# EAGLE design Qwiic_RockBLOCK_9603N (EAGLE 9.4.1)
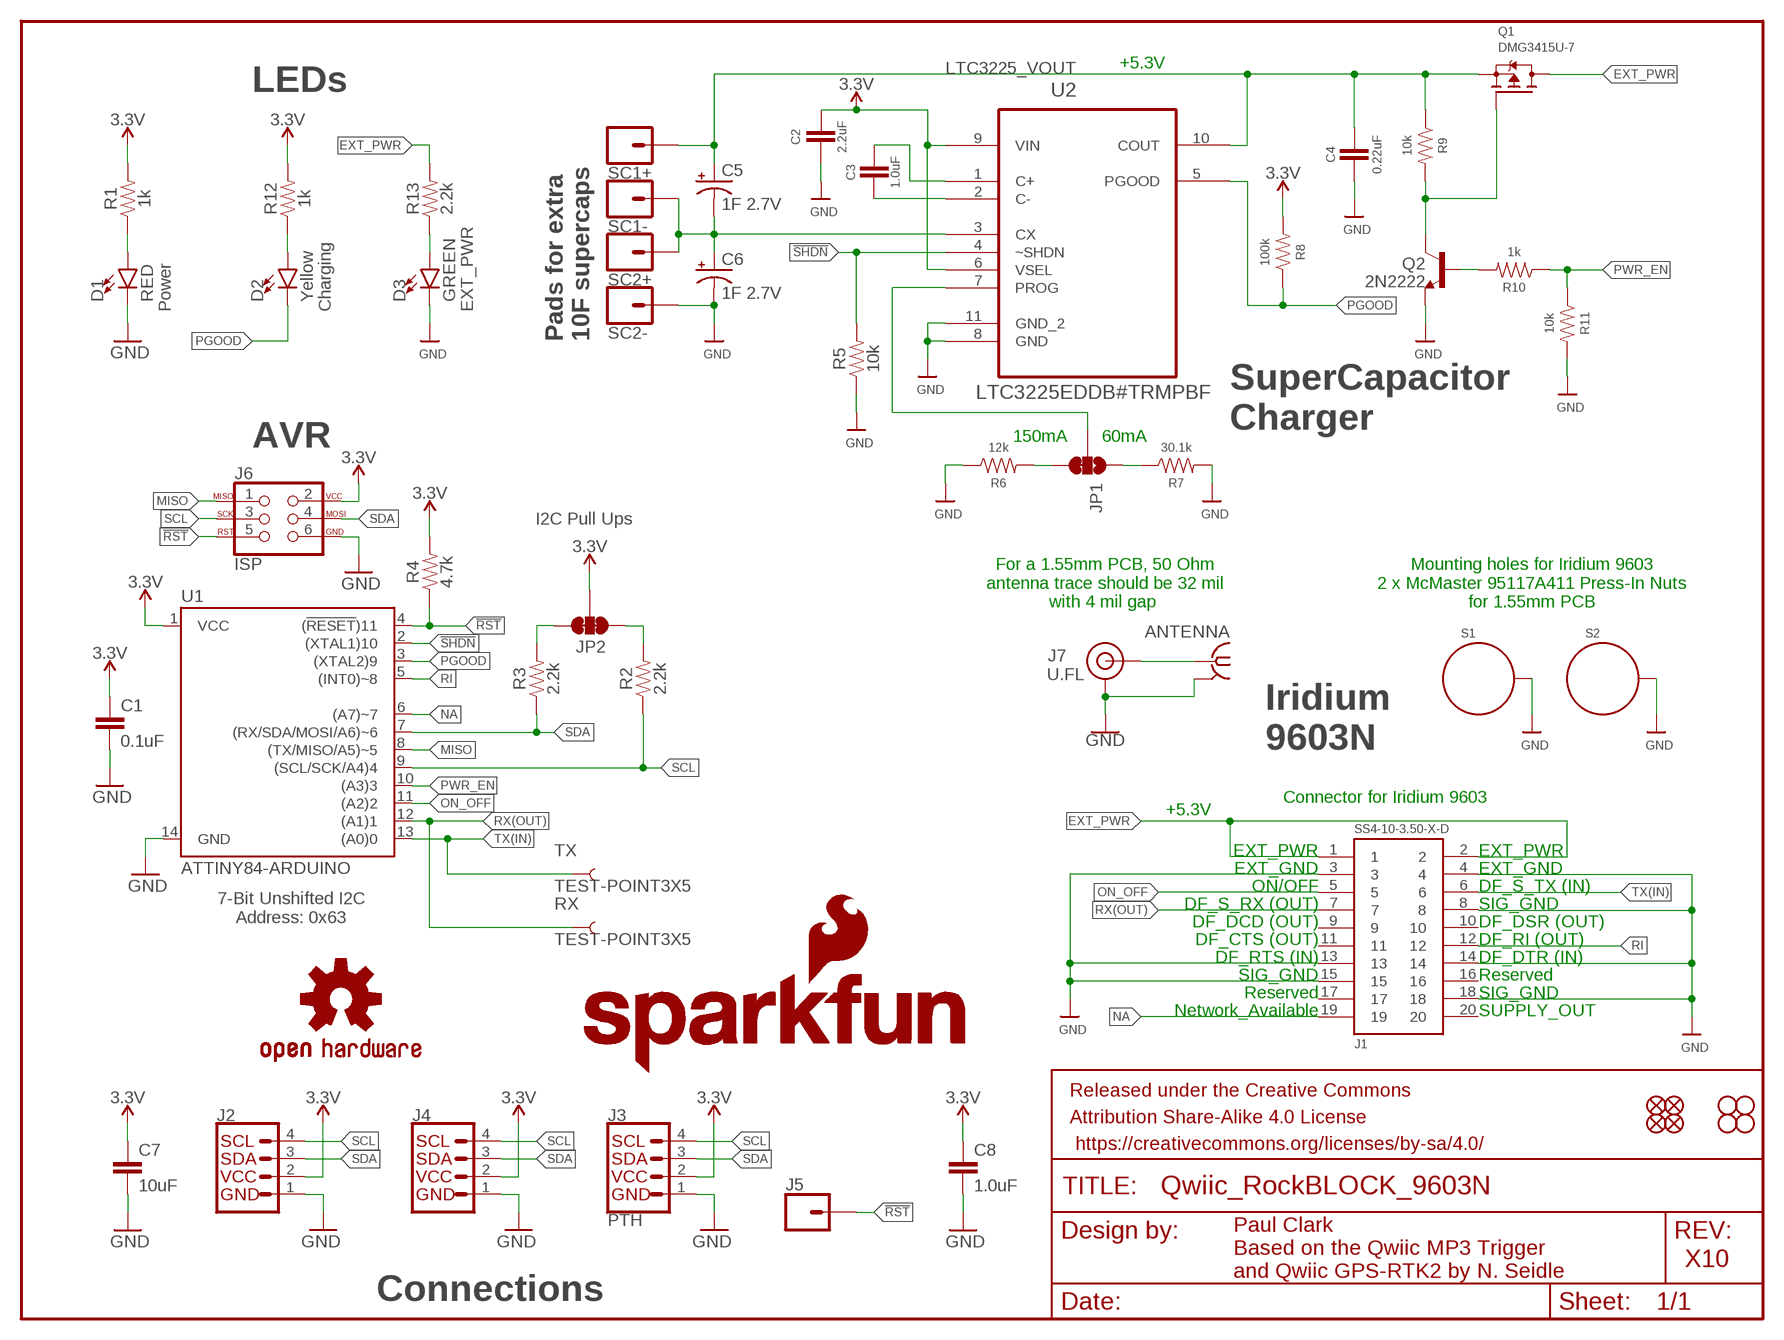
[diagram p0: schematic, sheet 1]

## Parts
ANTENNA  SMA-142-0711-821/826  [J502-ND-142-0711-821/826]
C1  0.1uF  0.1UF-0603-25V-(+80/-20%)  [0603]
C2  2.2uF  2.2UF-0603-10V-20%  [0603]
C3  1.0uF  1.0UF-0603-16V-10%  [0603]
C4  0.22uF  0.22UF-0603-25V-10%  [0603]
C5  1F 2.7V  1F-2.7V(PTH)CPOL-RADIAL-1H-2.7V  [CPOL-RADIAL-1F-2.7V]
C6  1F 2.7V  1F-2.7V(PTH)CPOL-RADIAL-1H-2.7V  [CPOL-RADIAL-1F-2.7V]
C7  10uF  10UF-0603-6.3V-20%  [0603]
C8  1.0uF  1.0UF-0603-16V-10%  [0603]
D1  RED  LED-RED0603  [LED-0603]
D2  Yellow  LED-YELLOW0603  [LED-0603]
D3  GREEN  LED-GREEN0603  [LED-0603]
FRAME1  FRAME-LETTER  [CREATIVE_COMMONS]
J1  SS4-10-3.50-X-D  [SS4-10-3.50-X-D]
J2  QWIIC_CONNECTORJS-1MM  [1X04_1MM_RA]
J3  PTH  I2C_STANDARD_NO_SILK  [1X04_NO_SILK]
J4  QWIIC_CONNECTORJS-1MM  [1X04_1MM_RA]
J5  CONN_01PTH_NO_SILK_YES_STOP  [1X01_NO_SILK]
J6  ISP  AVR_SPI_PROG_3X2TESTPOINTS  [2X3_TEST_POINTS]
J7  U.FL  U.FL2PIN  [U.FL]
JP1  JUMPER-PAD-3-2OF3_NC_BY_TRACE_LARGE  [PAD-JUMPER-3-2OF3_NC_BY_TRACE_YES_SILK_LARGE]
JP2  JUMPER-SMT_3_2-NC_TRACE_SILK  [SMT-JUMPER_3_2-NC_TRACE_SILK]
JP3  STAND-OFF  [STAND-OFF]
JP4  STAND-OFF  [STAND-OFF]
JP5  FIDUCIALUFIDUCIAL  [MICRO-FIDUCIAL]
JP6  FIDUCIALUFIDUCIAL  [MICRO-FIDUCIAL]
JP7  FIDUCIALUFIDUCIAL  [MICRO-FIDUCIAL]
JP8  FIDUCIALUFIDUCIAL  [MICRO-FIDUCIAL]
JP9  STAND-OFF  [STAND-OFF]
JP10  STAND-OFF  [STAND-OFF]
LOGO1  OSHW-LOGOMINI  [OSHW-LOGO-MINI]
LOGO2  SFE_LOGO_NAME.1_INCH  [SFE_LOGO_NAME_.1]
LOGO3  SFE_LOGO_NAME_FLAME.1_INCH  [SFE_LOGO_NAME_FLAME_.1]
Q1  DMG3415U-7  MOSFET-PWIDE  [SOT23-WIDE]
Q2  2N2222  MMBT2222ALT1-NPN-SOT23-BEC  [SOT23-BEC]
R1  1k  1KOHM-0603-1/10W-1%  [0603]
R2  2.2k  2.2KOHM-0603-1/10W-1%  [0603]
R3  2.2k  2.2KOHM-0603-1/10W-1%  [0603]
R4  4.7k  4.7KOHM-0603-1/10W-1%  [0603]
R5  10k  10KOHM-0603-1/10W-1%  [0603]
R6  12k  12KOHM-0603-1/10W-1%  [0603]
R7  30.1k  30.1KOHM-0603-1/10W-1%  [0603]
R8  100k  100KOHM-0603-1/10W-1%  [0603]
R9  10k  10KOHM-0603-1/10W-1%  [0603]
R10  1k  1KOHM-0603-1/10W-1%  [0603]
R11  10k  10KOHM-0603-1/10W-1%  [0603]
R12  1k  1KOHM-0603-1/10W-1%  [0603]
R13  2.2k  2.2KOHM-0603-1/10W-1%  [0603]
RX  TEST-POINT3X5  [PAD.03X.05]
S1  STANDOFF_ELECTRICALMCMASTER-95117A411  [STANDOFF-ELECTRICAL-MCMASTER-95117A411]
S2  STANDOFF_ELECTRICALMCMASTER-95117A411  [STANDOFF-ELECTRICAL-MCMASTER-95117A411]
SC1+  CONN_01PTH_NO_SILK_YES_STOP  [1X01_NO_SILK]
SC1-  CONN_01PTH_NO_SILK_YES_STOP  [1X01_NO_SILK]
SC2+  CONN_01PTH_NO_SILK_YES_STOP  [1X01_NO_SILK]
SC2-  CONN_01PTH_NO_SILK_YES_STOP  [1X01_NO_SILK]
TX  TEST-POINT3X5  [PAD.03X.05]
U1  ATTINY84-ARDUINO  [SO14]
U2  LTC3225EDDB#TRMPBF  LTC3225EDDB-TRMPBFDFN300X200-10L  [DFN300X200-10L]

## Nets
3.3V [3.3V]: C1.1 C2.1 C7.1 C8.1 J2.2 J3.2(VCC) J4.2 J6.2 JP2.2 R1.2 R4.2 R8.2 R12.2 U1.1(VCC) U2.6(VSEL) U2.9(VIN)
!RST: J5.1 J6.5 R4.1 U1.4((!RESET!)11)
!SHDN: R5.2 U1.2((XTAL1)10) U2.4(~SHDN)
EXT_PWR: J1.1 J1.2 Q1.3(D) R13.2
GND: ANTENNA.G@1 ANTENNA.G@2 ANTENNA.G@3 ANTENNA.G@4 C1.2 C2.2 C4.2 C6.- C7.2 C8.2 D1.C D3.C J1.3 J1.4 J1.8 J1.13 J1.14 J1.15 J1.18 J2.1 J3.1(GND) J4.1 J6.6 J7.1(GND) J7.2(GND) Q2.E R5.1 R6.1 R7.2 R11.2 S1.P1 S2.P1 SC2-.1 U1.14(GND) U2.8(GND) U2.11(GND_2)
LTC3225_VOUT: C4.1 C5.+ Q1.2(S) R9.1 SC1+.1 U2.10(COUT)
MISO: J6.1 U1.8((TX/MISO/A5)~5)
N$1: C5.- C6.+ SC1-.1 SC2+.1 U2.3(CX)
N$2: JP1.3 R6.2
N$3: D1.A R1.1
N$4: JP1.1 R7.1
N$5: D2.A R12.1
N$6: D3.A R13.1
N$7: ANTENNA.1 J7.FEED(SIGNAL)
N$9: C3.2 U2.2(C-)
N$10: C3.1 U2.1(C+)
N$11: JP1.2 U2.7(PROG)
N$19: Q1.1(G) Q2.C R9.2
N$20: Q2.B R10.2
NA: J1.19 U1.6((A7)~7)
ON_OFF: J1.5 U1.11((A2)2)
PGOOD: D2.C R8.1 U1.3((XTAL2)9) U2.5(PGOOD)
PWR_EN: R10.1 R11.1 U1.10((A3)3)
RI: J1.12 U1.5((INT0)~8)
RX(OUT): J1.7 RX.P$1 U1.12((A1)1)
SCL: J2.4 J3.4(SCL) J4.4 J6.3 R2.1 U1.9((SCL/SCK/A4)4)
SCL_PU1: JP2.1 R2.2
SDA: J2.3 J3.3(SDA) J4.3 J6.4 R3.1 U1.7((RX/SDA/MOSI/A6)~6)
SDA_PU1: JP2.3 R3.2
TX(IN): J1.6 TX.P$1 U1.13((A0)0)
Unconnected: J1.9 J1.10 J1.11 J1.16 J1.17 J1.20

## Notes on the sheet
- +5.3V
- LEDs
- Power | Charging | EXT_PWR
- Pads for extra
  10F supercaps
- SuperCapacitor
  Charger
- 150mA | 60mA
- AVR
- I2C Pull Ups
- For a 1.55mm PCB, 50 Ohm
  antenna trace should be 32 mil
  with 4 mil gap
- Mounting holes for Iridium 9603
  2 x McMaster 95117A411 Press-In Nuts
  for 1.55mm PCB
- Iridium
  9603N
- Connector for Iridium 9603
- +5.3V
- EXT_PWR | EXT_PWR
- EXT_GND | EXT_GND
- ON/OFF | DF_S_TX (IN)
- DF_S_RX (OUT) | SIG_GND
- 7-Bit Unshifted I2C
  Address: 0x63
- DF_DCD (OUT) | DF_DSR (OUT)
- DF_CTS (OUT) | DF_RI (OUT)
- DF_RTS (IN) | DF_DTR (IN)
- SIG_GND | Reserved
- Reserved | SIG_GND
- Network_Available | SUPPLY_OUT
- X10
- Paul Clark
  Based on the Qwiic MP3 Trigger
  and Qwiic GPS-RTK2 by N. Seidle
- Connections

## Library data of the parts
ANTENNA = con-coax:SMA-: SMA 50 Ohm End Launch Jack Receptacle - Round Contact Johnson Components Source: www.johnsoncomponents.com .. J502-ND.pdf; MF: JOHNSON COMPONENTS; MPN: 142-0711-821; OC_FARNELL: 1019328; OC_NEWARK: 16F3627
C1 = SparkFun-Capacitors:0.1UF: 0.1µF ceramic capacitors A capacitor is a passive two-terminal electrical component used to store electrical energy temporarily in an electric field.; PROD_ID: CAP-00810
C2 = SparkFun-Capacitors:2.2UF: 2.2µF ceramic capacitors A capacitor is a passive two-terminal electrical component used to store electrical energy temporarily in an electric field.; PROD_ID: CAP-07888
C3 C8 = SparkFun-Capacitors:1.0UF: 1µF ceramic capacitors A capacitor is a passive two-terminal electrical component used to store electrical energy temporarily in an electric field.; PROD_ID: CAP-00868
C4 = SparkFun-Capacitors:0.22UF: 0.22µF ceramic capacitors A capacitor is a passive two-terminal electrical component used to store electrical energy temporarily in an electric field.; PROD_ID: CAP-07822
C5 C6 = SparkFun-Capacitors:1F-2.7V(PTH): CAP-08070
C7 = SparkFun-Capacitors:10UF: 10.0µF ceramic capacitors A capacitor is a passive two-terminal electrical component used to store electrical energy temporarily in an electric field.; PROD_ID: CAP-11015
D1 = SparkFun-LED:LED-RED: Red SMD LED Used in manufacturing of most products at SparkFun Packages: 0603 - SMD 0603 package [Product Link] <http://docs.avagotech.com/docs/AV02-0551EN> 0603 SMART - SMD 0603 SMART package ( more efficient and expensive)[Product Link] <http://www.osram-os.com/Graphics/XPic2/00077099_0.pdf> 1206 - SMD1206 package [Product Link] <https://www.sparkfun.com/datasheets/DevTools/LilyPad/Q150OVS4.pdff> SparkFun Products: Pro Mini 328 -5V <https://www.sparkfun.com/products/821> RedBoard <https://www.sparkfun.com/products/12757> IOIO-OTG <https://www.sparkfun.com/products/13613>; PROD_ID: DIO-00819
D2 = SparkFun-LED:LED-YELLOW: Yellow SMD LED Used in manufacturing several products at SparkFun. Packages: 0603 - SMD 0603 package[Product Link] <http://www.kingbrightusa.com/product.asp?catalog_name=LED&product_id=APT1608SYCK> 0603 -SMART - SMART SMD 0603 package (more efficient/more expensive) [Product Link] <http://www.osram-os.com/osram_os/en/products/product-catalog/led-light-emitting-diodes/smartled-0603/ly-l29k/index.jsp> LilyPad - SMD1206 package[Product Datasheet] <https://www.sparkfun.com/datasheets/DevTools/LilyPad/Q150YUS4.pdf> SparkFun Products: Blynk Board <https://www.sparkfun.com/products/13794> IOIO-OTG <https://www.sparkfun.com/products/13613> XBee Explorer Serial <https://www.sparkfun.com/products/13225>; PROD_ID: DIO-09003
D3 = SparkFun-LED:LED-GREEN: Green SMD LED Used in manufacturing of various products at SparkFun Packages: 0603 - SMD 0603 package [Product Link] <http://www.futureelectronics.com/en/technologies/semiconductors/optoelectronics/leds/Pages/9894312-LTST-C190GKT.aspx?CrossPart=HSMG-C190&IM=0> LilyPad 1206 - SMD1206 LilyPad package [Product Link] <http://www.futureelectronics.com/en/Technologies/Product.aspx?ProductID=IN150NGHARVATEKCORPORATION2049943&IM=0> 1206 - SMD1206 package [Product Link] <http://www.futureelectronics.com/en/technologies/semiconductors/optoelectronics/leds/Pages/8315665-LTST-C150KGKT.aspx?IM=0> 1206 Bottom Mount -SMD 1206 Bottom Mount [Product Link] <http://www.digikey.com/product-detail/en/lite-on-inc/LTST-C230KGKT/160-1456-1-ND/386854> SparkFun Products: Pro Mini 328 -5V <https://www.sparkfun.com/products/821> RedBoard <https://www.sparkfun.com/products/12757> MP3 Trigger <https://www.sparkfun.com/products/13720> Makey Makey <https://www.sparkfun.com/products/11076>; PROD_ID: DIO-00821
FRAME1 = SparkFun-Aesthetics:FRAME-LETTER: Schematic Frame - Letter Standard 8.5x11 US Letter frame
J1 = SS4-10-3.50-X-D:SS4-10-3.50-X-D: 0.4mm[.016] SOCKET STRIP ASSEMBLY.
J2 J4 = SparkFun-Connectors:QWIIC_CONNECTOR: SparkFun I2C Standard Qwiic Connector An SMD 1mm pitch JST connector makes it easy and quick (get it? Qwiic?) to connect I2C devices to each other. The Qwiic system <http://www.sparkfun.com/qwiic> enables fast and solderless connection between popular platforms and various sensors and actuators. We carry 200mm <https://www.sparkfun.com/products/14204>, 100mm <https://www.sparkfun.com/products/14205>, 50mm <https://www.sparkfun.com/products/14206>, and breadboard friendly <https://www.sparkfun.com/products/14207> Qwiic cables. We also offer 10 pcs strips <https://www.sparkfun.com/products/14323> the SMD connectors.; PROD_ID: CONN-13694
J3 = SparkX:I2C_STANDARD: SparkFun I2C Standard Pinout Header SparkFun has standardized on a pinout for all I2C based sensor breakouts. This pinout allows I2C boards to be plugged directly into the headers on Arduino Uno compatible boards, and to be daisy chained easily. Example SparkFun Products: SparkFun Atmospheric Sensor Breakout - BME280 <https://www.sparkfun.com/products/13676> SparkFun Altitude/Pressure Sensor Breakout - MPL3115A2 <https://www.sparkfun.com/products/11084> SparkFun TOF Range Finder Sensor - VL6180 <https://www.sparkfun.com/products/12785>
J5 SC1+ SC1- SC2+ SC2- = SparkFun-Connectors:CONN_01: Single connection point. Often used as Generic Header-pin footprint for 0.1 inch spaced/style header connections On any of the 0.1 inch spaced packages, you can populate with these: Break Away Headers - Straight <https://www.sparkfun.com/products/116> (PRT-00116) Break Away Male Headers - Right Angle <https://www.sparkfun.com/products/553> (PRT-00553) Female Headers <https://www.sparkfun.com/products/115> (PRT-00115) Break Away Headers - Machine Pin <https://www.sparkfun.com/products/117> (PRT-00117) Break Away Female Headers - Swiss Machine Pin <https://www.sparkfun.com/products/743> (PRT-00743) This device is also useful as a general connection point to wire up your design to another part of your project. Our various solder wires solder well into these plated through hole pads. Hook-Up Wire - Assortment (Stranded, 22 AWG) <https://www.sparkfun.com/products/11375> (PRT-11375) Hook-Up Wire - Assortment (Solid Core, 22 AWG) <https://www.sparkfun.com/products/11367> (PRT-11367) View the entire wire category on our website here <https://www.sparkfun.com/categories/141> Special notes: SMTSO-256-ET is a "flush mount" nut for a 4-40 screw. We mostly use this on specialty testbeds; it is a nice way to connect hardware to your PCB at an adjustable hieght. Also note, the SNAP packages are for using a snappable style connector. We sell a baggie of snaps and they are also used on two LilyPad designs: Snap Assortment - 30 pack (male and female) <https://www.sparkfun.com/products/11347> (DEV-11347) LilyPad Arduino SimpleSnap <https://www.sparkfun.com/products/10941> (DEV-10941) LilyPad SimpleSnap Protoboard <https://www.sparkfun.com/products/10940> (DEV-10940)
J6 = SparkFun-Connectors:AVR_SPI_PROG_3X2: AVR ISP 6 Pin This is the reduced ISP connector for AVR programming. Common on Arduino. This footprint will take up less PCB space and can be used with a 10-pin to 6-pin adapter such as SKU: BOB-08508 **Special note about "TEST_POINT" package. The stop mask is on the top side, so if you want your programming test points to be on the bottom of your board, make sure to place this package on the bottom side of the board. This also ensure that the orientation to program from the bottom side will be correct. SparkFun Products: SparkFun ISP Pogo Adapter <https://www.sparkfun.com/products/11591> - NS Tiny AVR Programmer <https://www.sparkfun.com/products/11801> -PTH
J7 = SparkFun-Connectors:U.FL2PIN: SMD Antenna Connector - U.FL 2mm height, 3.0mm x 3.0mm receptacle size. SparkFun Products: SparkFun WiFi Shield - ESP8266 <https://www.sparkfun.com/products/13287> SparkFun ESP8266 Thing <https://www.sparkfun.com/products/13231> SparkFun MiniGen - Pro Mini Signal Generator Shield <https://www.sparkfun.com/products/11420>; PROD_ID: CONN-09193; SF_ID: WRL-09144
JP1 = SparkFun-Passives:JUMPER-PAD-3-2OF3_NC_BY_TRACE
JP2 = SparkFun-Jumpers:JUMPER-SMT_3_2-NC_TRACE: Normally closed trace jumper (2 of 2 connections) This jumper has a trace between all three pads so they are normally closed (NC). Use a razor knife to open the connection(s). For best results follow the IPC guidelines for cutting traces: Cutout at least 0.063 mm (0.005 in). Remove all loose material to clean up the cut area. Seal the cut with an approved epoxy. Reapply solder to reclose the connection(s).
JP3 JP4 JP9 JP10 = SparkFun:STAND-OFF: Stand Off This is the mechanical footprint for a #4 phillips button head screw. Use the keepout ring to avoid running the screw head into surrounding components. SKU : PRT-00447
JP5-JP8 = SparkFun:FIDUCIAL: Fiducial Alignment Points Various fiducial points for machine vision alignment.
LOGO1 = SparkFun-Aesthetics:OSHW-LOGO: Open-Source Hardware (OSHW) Logo This logo indicates the piece of hardware it is found on incorporates a OSHW license and/or adheres to the definition of open source hardware found here: http://freedomdefined.org/OSHW
LOGO2 = SparkFun-Aesthetics:SFE_LOGO_NAME: SparkFun Font Logo This is the SparkFun name logo. The logo on the schematic will always be the same size; the package variant is the height of the flame part of the logo (or the height the flame would be, if it were drawn). Default layer for the logo on the board is tSilk.
LOGO3 = SparkFun-Aesthetics:SFE_LOGO_NAME_FLAME: SparkFun Font Logo w/ Flame This is the SparkFun full logo. The logo on the schematic will always be the same size; the package variant is the height of the flame part of the logo. Default layer for the logo on the board is tSilk.
Q1 = microbuilder:MOSFET-P: P-Channel Mosfet LEGEND VDS: Voltage Drain-Source ID: Drain Current RDS(ON): Drain-Source On-State Resistance VGS(TH): Gate-Source Threshold Voltage CISS: Drain-Source Input Capacitance SOT-23 Name VDS ID RDS(ON) VGS(TH) CISS Order Number IRLML5103 30V 760mA 600 mOhm -- 75pF @ 25V Digikey: IRLML5103PBFCT-ND IRLML6401 12V 4.3A 50 mOhm 950mV @ 250µA 830pF @ 10V Digikey: IRLML6401PBFTR-ND NTR0202PL 20V 400mA 800 mOhm 2.3V @ 250uA 70pF @ 5V Digikey: NTR0202PLT1GOSTR-ND NTR4101PT1G 20V 1.8A 85 mOhm 1.2V @ 250uA 675pF @ 10V Digikey: NTR4101PT1GOSCT-ND DMP2004K 20V 600mA 900 mOhm 1V @ 250uA 175pF @ 16V Digikey: DMP2004KDICT-ND PMV65XP 20V 3.9A 76 mOhm 950mV @ 1mA 725pF @ 20V Digikey: 568-2358-2-ND TO-252 Name VDS ID RDS(ON) VGS(TH) CISS Order Number AOD417 30V 25A 34 mOhm 3V @ 250µA 920pF @ 15V Digikey: 785-1106-2-ND
Q2 = transistor:*-NPN-: NPN Transistror BF959 corrected 2008.03.06
R1 R10 R12 = SparkFun-Resistors:1KOHM: 1kΩ resistor A resistor is a passive two-terminal electrical component that implements electrical resistance as a circuit element. Resistors act to reduce current flow, and, at the same time, act to lower voltage levels within circuits. - Wikipedia; PROD_ID: RES-07856
R2 R3 R13 = SparkFun-Resistors:2.2KOHM: 2.2kΩ resistor A resistor is a passive two-terminal electrical component that implements electrical resistance as a circuit element. Resistors act to reduce current flow, and, at the same time, act to lower voltage levels within circuits. - Wikipedia; PROD_ID: RES-08272
R4 = SparkFun-Resistors:4.7KOHM: 4.7kΩ resistor A resistor is a passive two-terminal electrical component that implements electrical resistance as a circuit element. Resistors act to reduce current flow, and, at the same time, act to lower voltage levels within circuits. - Wikipedia; PROD_ID: RES-07857
R5 R9 R11 = SparkFun-Resistors:10KOHM: 10kΩ resistor A resistor is a passive two-terminal electrical component that implements electrical resistance as a circuit element. Resistors act to reduce current flow, and, at the same time, act to lower voltage levels within circuits. - Wikipedia; PROD_ID: RES-00824
R6 = SparkFun-Resistors:12KOHM: 12kΩ resistor A resistor is a passive two-terminal electrical component that implements electrical resistance as a circuit element. Resistors act to reduce current flow, and, at the same time, act to lower voltage levels within circuits. - Wikipedia; PROD_ID: RES-10327
R7 = SparkFun-Resistors:30.1KOHM: 30.1kΩ resistor A resistor is a passive two-terminal electrical component that implements electrical resistance as a circuit element. Resistors act to reduce current flow, and, at the same time, act to lower voltage levels within circuits. - Wikipedia; PROD_ID: RES-08595
R8 = SparkFun-Resistors:100KOHM: 100kΩ resistor A resistor is a passive two-terminal electrical component that implements electrical resistance as a circuit element. Resistors act to reduce current flow, and, at the same time, act to lower voltage levels within circuits. - Wikipedia; PROD_ID: RES-07828
RX TX = SparkFun-Connectors:TEST-POINT: SparkFun Test Points Bare copper test points for troubleshooting or In-Circuit-Testing. These are used by our Production team for verifying production board runs using pogo-pins on test beds. SparkFun Products: SparkFun LSM9DS1 Breakout <https://www.sparkfun.com/products/13284> SparkFun PSOC <https://www.sparkfun.com/products/13714> SparkFun Load Cell Amplifier <https://www.sparkfun.com/products/13879>
S1 S2 = SparkFun-Electromechanical:STANDOFF_ELECTRICAL: A standoff intended to be an electrically connected point.
U1 = SparkFun-IC-Microcontroller:ATTINY84-ARDUINO; PROD_ID: IC-14155
U2 = LTC_By_element14_Batch_1:LTC3225EDDB-TRMPBF: 150mA Supercapacitor Charger

## Net classes
1 3.3V: width 0.305 mm

## Board
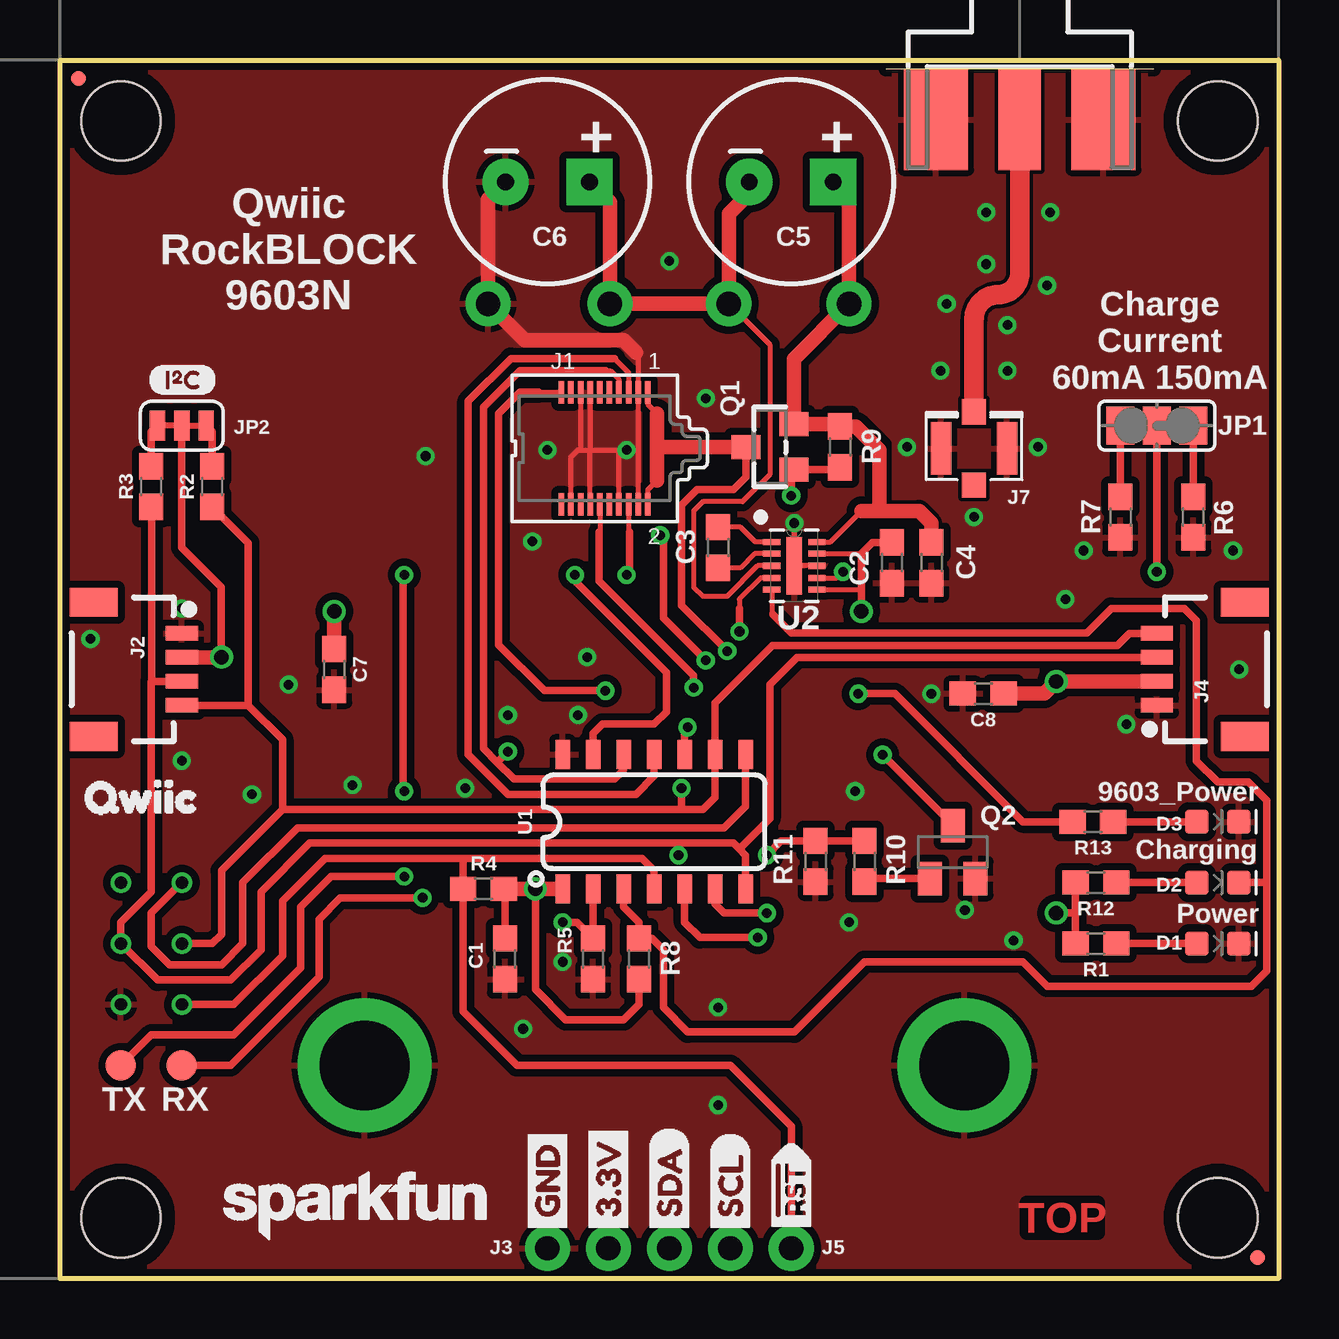
[diagram p1: board, top side]
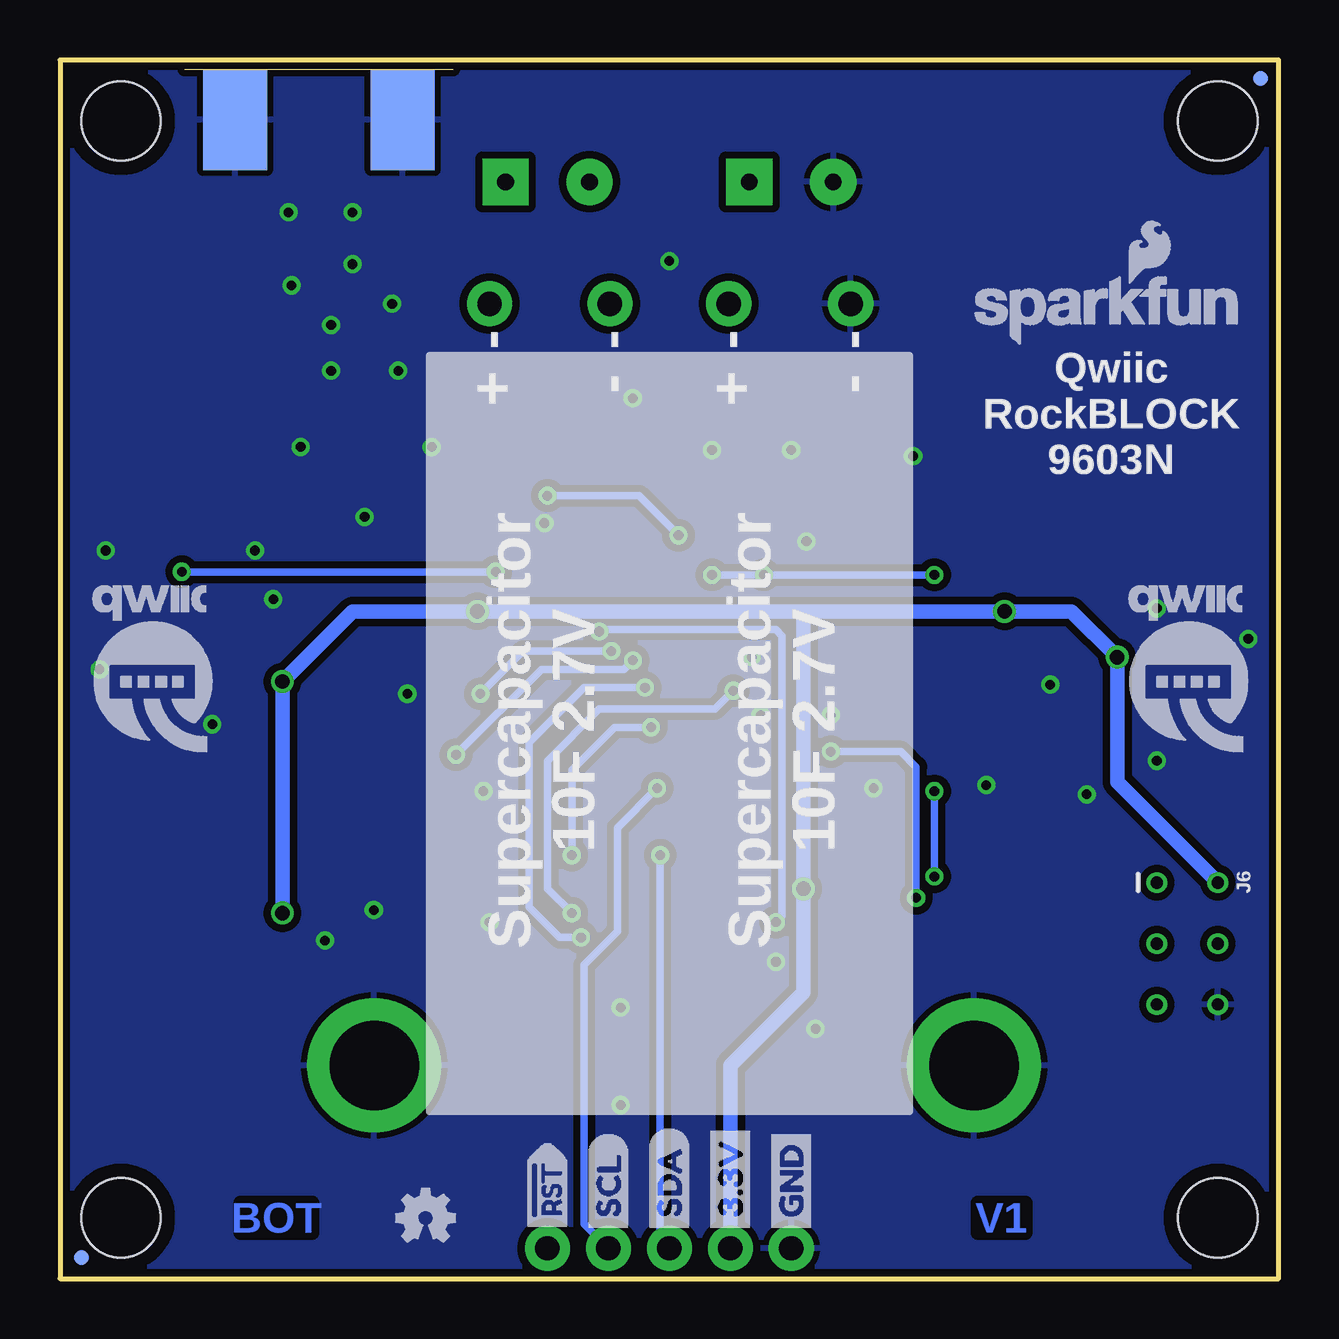
[diagram p2: board, bottom side, seen from below]

Size 50.8 x 50.8 mm. Coordinates in mm from the lower left corner, seen from the top.
Outline: 0,0 0,50.8 50.8,50.8 50.8,0 0,0
Copper layers (1*16): Top 0.035mm / dielectric 1.5mm / Bottom 0.035mm
Design rules "SparkFun-2-layer-PCBWay-LIMIT *": minimum track width 6mil, minimum drill 0.3mm, track to track 6mil, track to pad 6mil, pad to pad 6mil, via to via 6mil, smd to smd 6mil, copper to edge 6mil, drill to drill 6mil, minimum pad ring 7mil, minimum via ring 7mil, stop-mask expansion 4mil, vias tented up to drill 25mil, thermal gap 10mil

### Footprints (pad centres in the part's own frame; a part is rotated, then mirrored left to right if it is on the bottom)
J502-ND-142-0711-821/826 = smd 4.191 x 1.778: 1 2.115,0 | smd 4.191 x 2.667: G@1 2.115,3.495; G@2 2.115,-3.495 | smd 4.191 x 2.667 bottom: G@3 2.115,3.495; G@4 2.115,-3.495
0603 = smd 1.1 x 1: 1 -0.85,0; 2 0.85,0
CPOL-RADIAL-1F-2.7V = drill 0.7 pad 1.93 square: + 1.75,0 | drill 0.7 pad 1.93: - -1.75,0
LED-0603 = smd 1 x 1: A -0.877,0; C 0.877,0
SS4-10-3.50-X-D = smd 0.23 x 0.93: 1 1.8,2.335; 2 1.8,-2.335; 3 1.4,2.335; 4 1.4,-2.335; 5 1,2.335; 6 1,-2.335; 7 0.6,2.335; 8 0.6,-2.335; 9 0.2,2.335; 10 0.2,-2.335; 11 -0.2,2.335; 12 -0.2,-2.335; 13 -0.6,2.335; 14 -0.6,-2.335; 15 -1,2.335; 16 -1,-2.335; 17 -1.4,2.335; 18 -1.4,-2.335; 19 -1.8,2.335; 20 -1.8,-2.335
1X04_1MM_RA = smd 0.6 x 1.35: 1 -1.5,0; 2 -0.5,0; 3 0.5,0; 4 1.5,0 | smd 1.2 x 2: NC1 2.8,-3.675; NC2 -2.8,-3.675
1X04_NO_SILK = drill 1.016 pad 1.88: 1 0,0; 2 2.54,0; 3 5.08,0; 4 7.62,0
1X01_NO_SILK = drill 1.016 pad 1.88: 1 0,0
2X3_TEST_POINTS = drill 0.508: 1 -2.54,-1.27; 2 -2.54,1.27; 3 0,-1.27; 4 0,1.27; 5 2.54,-1.27; 6 2.54,1.27
U.FL = smd 2.2 x 0.85: 1 0,1.375; 2 0,-1.375 | smd 1.05 x 1: FEED 1.525,0; NC -1.525,0
PAD-JUMPER-3-2OF3_NC_BY_TRACE_YES_SILK_LARGE = smd 1.168 x 1.6: 1 -1.524,0; 2 0,0; 3 1.524,0
SMT-JUMPER_3_2-NC_TRACE_SILK = smd 0.635 x 1.27: 1 -1.016,0; 2 0,0; 3 1.016,0
STAND-OFF = hole 3.302: 0,0
MICRO-FIDUCIAL = smd 0.635 x 0.635: 1 0,0
SOT23-WIDE = smd 1 x 1.2: 1 -0.95,-1; 2 0.95,-1; 3 0,1
SOT23-BEC = smd 1 x 1.4: B -0.95,-1.1; C 0,1.1; E 0.95,-1.1
PAD.03X.05 = smd 1.27 x 1.27: P$1 0,0
STANDOFF-ELECTRICAL-MCMASTER-95117A411 = drill 3.734 pad 5.588: P1 0,0
SO14 = smd 0.6 x 1.2: 1 -3.175,-2.8; 2 -1.905,-2.8; 3 -0.635,-2.8; 4 0.635,-2.8; 5 1.905,-2.8; 6 3.175,-2.8; 7 4.445,-2.8; 8 4.445,2.8; 9 3.175,2.8; 10 1.905,2.8; 11 0.635,2.8; 12 -0.635,2.8; 13 -1.905,2.8; 14 -3.175,2.8
DFN300X200-10L = smd 0.711 x 0.254: 1 -0.94,0.991; 2 -0.94,0.508; 3 -0.94,0; 4 -0.94,-0.508; 5 -0.94,-0.991; 6 0.94,-0.991; 7 0.94,-0.508; 8 0.94,0; 9 0.94,0.508; 10 0.94,0.991 | smd 0.635 x 2.388: 11 0,0

### Placement (x,y rotation side)
ANTENNA  40.01,50.42 270 top
C1  18.54,13.34 270 top
C2  34.67,29.84 270 top
C3  27.43,30.48 270 top
C4  36.32,29.84 270 top
C5  30.48,45.72 0 top
C6  20.32,45.72 0 top
C7  11.43,25.4 270 top
C8  38.48,24.38 180 top
D1  48.26,13.97 0 top
D2  48.26,16.51 0 top
D3  48.26,19.05 0 top
FRAME1  -7.62,-10.16 0 top  (outside the outline)
J1  22.7,34.61 0 top
J2  5.08,25.4 270 top
J3  20.32,1.27 0 top
J4  45.72,25.4 90 top
J5  30.48,1.27 0 top
J6  3.81,13.97 270 bottom
J7  38.1,34.61 90 top
JP1  45.72,35.56 0 top
JP2  5.08,35.56 180 top
JP3  2.54,48.26 0 top
JP4  48.26,48.26 0 top
JP5  49.91,0.89 0 bottom
JP6  0.76,50.04 0 top
JP7  0.76,50.04 0 bottom
JP8  49.91,0.89 0 top
JP9  48.26,2.54 0 top
JP10  2.54,2.54 0 top
LOGO1  35.56,2.54 0 bottom
LOGO2  12.32,3.05 0 top
LOGO3  7.11,40.39 0 bottom
Q1  29.59,34.67 90 top
Q2  37.21,17.78 0 top
R1  43.18,13.97 180 top
R2  6.35,33.02 90 top
R3  3.81,33.02 90 top
R4  17.65,16.26 0 top
R5  22.23,13.34 90 top
R6  47.24,31.75 90 top
R7  44.2,31.75 270 top
R8  24.13,13.34 270 top
R9  32.51,34.67 270 top
R10  33.53,17.4 270 top
R11  31.5,17.4 270 top
R12  43.18,16.51 180 top
R13  43.05,19.05 180 top
RX  5.08,8.89 0 top
S1  12.7,8.89 0 top
S2  37.7,8.89 0 top
SC1+  32.89,40.64 0 top
SC1-  27.88,40.64 0 top
SC2+  22.92,40.64 0 top
SC2-  17.84,40.64 0 top
TX  2.54,8.89 0 top
U1  24.13,19.05 0 top
U2  30.61,29.72 0 top
U$1  [QWIIC-LOGO-MEDIUM]  46.99,25.4 0 bottom
U$3  [GND1]  20.32,1.65 90 bottom
U$4  [3#3V2]  22.86,1.65 90 bottom
U$5  [SDA8]  25.4,1.65 90 bottom
U$6  [SCL9]  27.94,1.65 90 bottom
U$7  [RST#-[>]  30.48,1.52 90 top
U$8  [I_SUPER2_C-()-03]  3.68,37.47 0 top
U$16  [RST#-[>]  30.48,1.52 90 bottom
U$21  [3#3V2]  22.86,1.65 90 top
U$22  [GND1]  20.32,1.65 90 top
U$23  [QWIIC0]  -0.13,20.07 0 top
U$26  [SCL9]  27.94,1.65 90 top
U$27  [SDA8]  25.4,1.65 90 top
U$47  [QWIIC-LOGO-MEDIUM]  3.81,25.4 0 bottom

### Tracks (layer width: path | path; a pad name or v marks a point on that pad's centre or on a via)
3.3V  (via drill 0.6)
  Top 0.203: U2.9 33.4,30.23 | U2.6 33.38,28.73
  Top 0.305: C1.1 18.54,16.22 R4.2 | R8.2 24.13,11.43 23.5,10.79 21.08,10.79 19.82,12.06 v19.82,16.25 | JP2.2 5.08,30.48 6.72,28.84 v6.72,25.9 | C2.1 33.87,30.7 33.4,30.23 33.4,28.7 | 33.4,28.7 v33.4,27.81 | 33.38,28.73 33.4,28.7 | R12.2 42.33,15.24 | 42.33,15.24 R1.2 | v41.53,15.24 42.33,15.24
  Top 0.61: J2.2 v6.72,25.9 v6.73,25.91 | J4.2 v41.53,24.89 41.02,24.38 C8.1 | U1.1 v19.82,16.25 v19.81,16.26 R4.2 | C7.1 v11.43,27.81
  Bottom 0.61: 19.81,27.81 v11.43,27.81 8.64,27.81 v6.73,25.91 6.73,20.7 J6.2 | 19.81,27.81 v33.4,27.81 38.61,27.81 v41.53,24.89 v41.53,15.24 | 19.81,27.81 v19.81,16.26 19.81,11.94 22.86,8.89 J3.2
!RST
  Top 0.305: J6.5 7.24,11.43 9.27,13.46 9.27,15.75 11.05,17.53 16.89,17.53 | U1.4 24.77,17.02 24.26,17.53 16.89,17.53 | 16.89,17.53 16.8,17.44 R4.1 16.8,11.14 19.05,8.89 27.94,8.89 30.48,6.35 J5.1
!SHDN  (via drill 0.4)
  Top 0.203: U2.4 29.21,29.21 28.32,28.32 28.32,27.94
  Top 0.305: U1.2 R5.2 21.55,14.86 v20.95,14.86 | v28.32,26.98 28.32,27.94
  Bottom 0.305: v20.95,14.86 20.7,15.11 20.7,26.8 20.95,27.05 28.25,27.05 v28.32,26.98
EXT_PWR  (via drill 0.4)
  Top 0.203: J1.1 24.5,36.46 24.89,36.07 | J1.2 24.5,32.88 24.89,33.27
  Top 0.305: Q1.3 28.59,33.42 28.07,32.89 26.54,32.89 25.91,32.26 25.91,28.07 v27.81,26.16 | v33.27,24.38 34.8,24.38 40.13,19.05 R13.2
  Top 0.61: 24.89,36.07 24.89,34.67 | 24.89,34.67 24.89,33.27 | Q1.3 24.89,34.67
  Bottom 0.305: v27.81,26.16 31.5,26.16 v33.27,24.38
GND  (via drill 0.4)
  Top 0.203: 24.1,34.54 J1.3 24.1,38.51 24,38.61 | 24.1,34.54 J1.4 | J1.18 21.3,34.25 21.59,34.54 21.72,34.54 | 21.72,34.54 22.1,34.54 | 22.1,34.54 23.37,34.54 | 23.37,34.54 24.1,34.54 | J1.15 21.7,34.56 21.72,34.54 | J1.13 22.1,34.55 | 22.1,34.55 22.1,34.54 | J1.14 22.1,34.55 | J1.8 23.3,34.48 23.37,34.54 | U2.8 U2.11 v30.61,31.5
  Top 0.61: C6.- 17.84,44.99 SC2-.1 19.37,39.12 23.5,39.12 24,38.61
  other vias: 20.95,13.21 27.43,11.3 5.08,21.59 5.08,27.94 1.27,26.67 20.32,34.54 42.67,30.35 48.9,30.35 44.45,23.11 37.72,15.37 39.75,14.1 18.67,23.5 21.59,23.5 16.89,20.45 36.7,37.85 39.5,37.85 38.61,44.45 41.27,44.45 38.61,42.29 39.5,39.75 35.31,34.67 40.77,34.67 38.1,31.75 41.15,41.4 36.96,40.64 21.97,25.91 19.68,30.73 15.24,34.29 8,20.19 33.15,20.32 23.62,34.54 32.89,14.86 27.43,7.24 19.3,10.41 49.15,25.4 41.91,28.32 12.19,20.57 26.92,36.7 25.4,42.42 9.53,24.77 36.32,24.38
  pour Bottom (isolate 0.305, rank 2): 0,0 0,50.8 50.8,50.8 50.8,0
  pour Top (isolate 0.305, rank 2): 0,0 0,50.8 50.8,50.8 50.8,0
  pour Top (isolate 0.102): 34.8,31.62 34.8,50.8 45.21,50.8 45.21,37.59 42.67,37.59 42.67,31.62
LTC3225_VOUT
  Top 0.203: U2.10 32.11,30.71 33.4,32
  Top 0.305: 32.41,35.62 R9.1
  Top 0.61: C5.+ 32.89,45.06 SC1+.1 30.59,38.34 Q1.2 32.41,35.62 | 33.4,32 34.16,32 | 34.16,32 35.81,32 36.32,31.5 C4.1 | R9.1 33.19,35.52 34.16,34.54 34.16,32
MISO
  Top 0.305: U1.8 28.57,19.68 27.69,18.8 9.91,18.8 7.62,16.51 7.62,13.97 6.73,13.08 4.57,13.08 3.81,13.84 3.81,15.24 J6.1
N$1
  Top 0.203: U2.3 29.08,29.72 27.81,28.45 26.8,28.45 26.42,28.83 26.42,32 26.8,32.38 28.45,32.38 29.59,33.53 29.59,38.92 SC1-.1
  Top 0.61: C5.- 28.73,45.24 27.88,44.39 SC1-.1 SC2+.1 22.92,44.87 C6.+
N$2
  Top 0.305: JP1.3 R6.2
N$3
  Top 0.305: R1.1 D1.A
N$4
  Top 0.305: JP1.1 R7.1
N$5
  Top 0.305: R12.1 D2.A
N$6
  Top 0.305: R13.1 D3.A
N$7
  Top 0.813: J7.FEED 38.1,40.01 arc-90 39.12,41.02 arc90 40.01,41.91 ANTENNA.1
N$9
  Top 0.203: U2.2 28.96,30.23 28.36,29.63 C3.2
N$10
  Top 0.203: U2.1 28.98,30.71 28.36,31.33 C3.1
N$11  (via drill 0.4)
  Top 0.203: U2.7 32.38,29.21 v32.64,29.46
  Top 0.305: JP1.2 v45.72,29.46
  Bottom 0.305: v45.72,29.46 v32.64,29.46
N$19  (via drill 0.4)
  Top 0.305: v25.02,30.99 25.15,30.86 25.15,27.55 v26.92,25.77 | v34.29,21.84 37.21,18.92 Q2.C | v30.48,32.64 30.48,33.61 Q1.1 32.41,33.72 R9.2
  Bottom 0.305: v30.48,32.64 26.67,32.64 v25.02,30.99 | v26.92,25.77 27.29,25.4 30.73,25.4 v34.29,21.84
N$20
  Top 0.305: R10.2 33.66,16.68 Q2.B
NA  (via drill 0.4)
  Top 0.203: J1.19 19.95,36.95 19.94,36.96
  Top 0.305: U1.6 27.3,15.62 27.69,15.24 v29.46,15.24 | 19.94,36.96 19.18,36.96 18.29,36.07 18.29,26.42 20.19,24.51 v22.73,24.51
  Bottom 0.305: v22.73,24.51 23.5,23.75 28.32,23.75 30.48,21.59 30.48,16.26 v29.46,15.24
ON_OFF
  Top 0.203: 23.11,38.35 23.7,37.77 J1.5
  Top 0.305: U1.11 24.77,20.95 24,20.19 18.67,20.19 17.02,21.84 17.02,36.58 18.8,38.35 23.11,38.35
PGOOD
  Top 0.203: U2.5 29.67,27.74 29.72,27.69
  Top 0.305: U1.3 23.5,15.49 24.13,14.86 R8.1 24.68,14.19 25.15,13.72 25.15,11.3 26.16,10.29 30.61,10.29 33.53,13.21 40.13,13.21 41.15,12.19 49.66,12.19 50.29,12.83 50.29,16.51 | 29.72,27.69 30.48,26.92 42.8,26.92 43.81,27.94 46.86,27.94 47.37,27.43 47.37,21.59 48.26,20.7 49.53,20.7 50.29,19.94 50.29,16.51 | D2.C 50.29,16.51
PWR_EN  (via drill 0.4)
  Top 0.305: R10.1 R11.1 30.06,18.25 v29.46,17.65 | U1.10 26.04,22.86 v26.16,22.99
  Bottom 0.305: v26.16,22.99 27.69,22.99 29.46,21.21 v29.46,17.65
RI  (via drill 0.4)
  Top 0.203: 22.48,31.11 22.51,31.15 22.51,32.26 J1.12
  Top 0.305: 22.48,31.11 22.48,29.08 26.42,25.15 v26.42,24.64 | v29.08,14.22 26.67,14.22 26.04,14.86 U1.5
  Bottom 0.305: v26.42,24.64 28.96,24.64 31.24,22.35 31.24,15.49 29.97,14.22 v29.08,14.22
RX(OUT)  (via drill 0.4)
  Top 0.203: 22.73,37.85 22.94,37.85 23.3,37.48 J1.7
  Top 0.305: U1.12 23.5,21.21 23.11,20.83 18.92,20.83 18.22,21.53 | 18.22,21.53 17.65,22.1 17.65,36.32 19.18,37.85 22.73,37.85 | RX.P$1 7.11,8.89 10.79,12.57 10.79,14.99 11.68,15.88 v15.11,15.88 | v18.67,21.97 18.22,21.53
  Bottom 0.305: v15.11,15.88 15.11,21.34 15.75,21.97 v18.67,21.97
SCL  (via drill 0.4)
  Top 0.305: J6.3 6.35,13.97 6.73,14.35 6.73,17.02 9.27,19.56 | 25.91,19.56 26.8,19.56 27.3,20.07 U1.9 27.3,24 29.69,26.39 44.07,26.39 44.58,26.9 J4.4 | 25.91,19.56 9.27,19.56 | J2.4 7.85,23.9 | 9.27,19.56 9.27,22.48 7.85,23.9 | R2.1 7.85,30.67 7.85,23.9 | 25.91,19.56 v25.91,20.45
  Bottom 0.305: v25.91,20.45 27.56,18.8 27.56,14.48 28.96,13.08 28.96,2.29 J3.4
SCL_PU1
  Top 0.305: JP2.1 6.35,35.31 R2.2
SDA  (via drill 0.4)
  Top 0.305: U1.7 28.57,17.65 28.32,17.91 | 28.32,17.91 28.07,18.16 25.78,18.16 | J4.3 30.73,25.9 29.59,24.77 29.59,19.18 28.32,17.91 | J2.3 3.82,24.9 | 3.82,24.9 3.81,24.89 3.81,16.13 2.54,14.86 J6.4 4.06,12.45 7.11,12.45 8.38,13.72 8.38,16.13 10.41,18.16 25.78,18.16 | R3.1 3.82,24.9 | 25.78,18.16 v25.78,17.65
  Bottom 0.305: v25.78,17.65 25.78,1.65 J3.3
SDA_PU1
  Top 0.305: JP2.3 3.81,35.31 R3.2
TX(IN)  (via drill 0.4)
  Top 0.203: 23.75,31.11 23.75,31.18 23.7,31.23 J1.6
  Top 0.305: U1.13 22.23,22.73 22.61,23.11 24.77,23.11 25.27,23.62 25.27,25.27 21.46,29.08 v21.46,29.34 | v23.62,29.34 23.75,29.46 23.75,31.11 | TX.P$1 3.81,10.16 7.24,10.16 10.03,12.95 10.03,15.49 11.3,16.76 v14.35,16.76 | v14.35,20.32 14.3,20.37 14.3,29.29 v14.35,29.34
  Bottom 0.305: v23.62,29.34 v21.46,29.34 v14.35,29.34 | v14.35,16.76 v14.35,20.32

### Text on the board
Top: TOP
Bottom: V1 | BOT
tPlace: + | + | Qwiic / RockBLOCK / 9603N | Charge / Current / 60mA 150mA | 9603_Power | Charging | Power | TX | RX
bPlace: - | - | - | - | - | - | Qwiic / RockBLOCK / 9603N | + | + | Supercapacitor / 10F 2.7V | Supercapacitor / 10F 2.7V
tValues: TPA2005D1